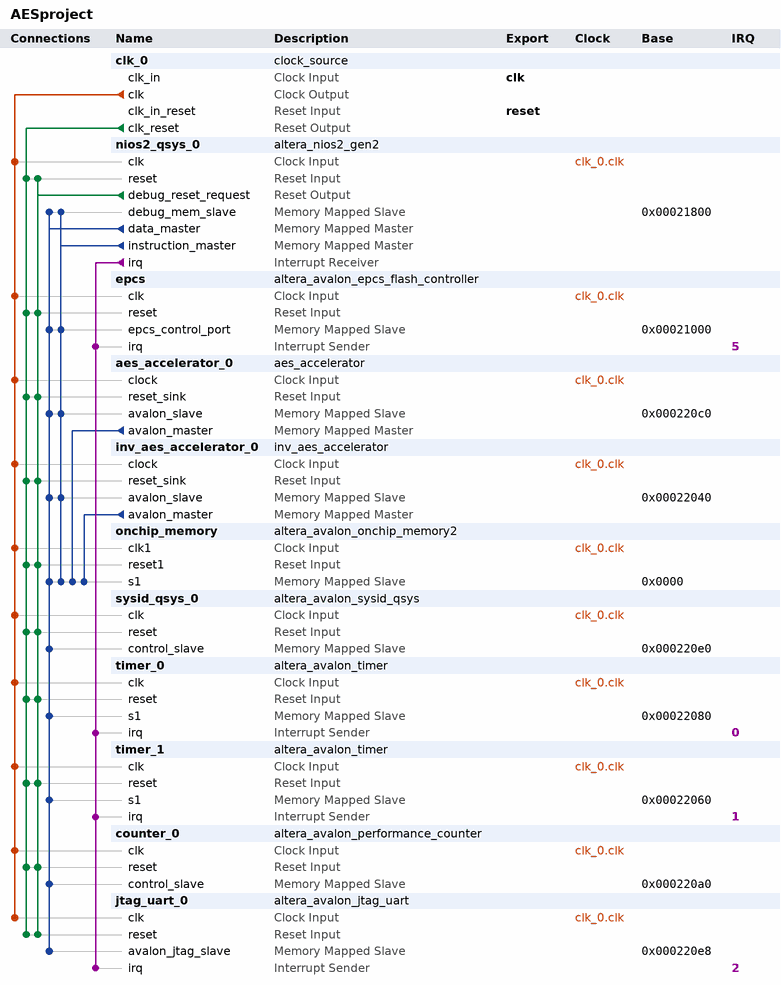
[diagram p0: system contents]
# Platform Designer (Qsys) system AESproject, Cyclone V 5CSEMA5F31C6
# Parameters at their usual value, and those the tool derives, are not listed.
package require -exact qsys 18.1
create_system AESproject
set_project_property DEVICE_FAMILY {Cyclone V}
set_project_property DEVICE 5CSEMA5F31C6

add_instance clk_0 clock_source 18.1
set_instance_parameter_value clk_0 clockFrequency 50000000

add_instance nios2_qsys_0 altera_nios2_gen2 18.1
set_instance_parameter_value nios2_qsys_0 dcache_size 0
set_instance_parameter_value nios2_qsys_0 exceptionSlave onchip_memory.s1
set_instance_parameter_value nios2_qsys_0 icache_size 4096
set_instance_parameter_value nios2_qsys_0 impl Fast
set_instance_parameter_value nios2_qsys_0 resetSlave epcs.epcs_control_port
set_instance_parameter_value nios2_qsys_0 setting_activateTrace true

add_instance epcs altera_avalon_epcs_flash_controller 18.1
set_instance_parameter_value epcs resetrequest_enabled true

add_instance aes_accelerator_0 aes_accelerator 1.0

add_instance inv_aes_accelerator_0 inv_aes_accelerator 1.0

add_instance onchip_memory altera_avalon_onchip_memory2 18.1
set_instance_parameter_value onchip_memory dataWidth 32
set_instance_parameter_value onchip_memory dualPort false
set_instance_parameter_value onchip_memory initMemContent true
set_instance_parameter_value onchip_memory initializationFileName onchip_memory
set_instance_parameter_value onchip_memory memorySize 100000

add_instance sysid_qsys_0 altera_avalon_sysid_qsys 18.1
set_instance_parameter_value sysid_qsys_0 id 0

add_instance timer_0 altera_avalon_timer 18.1
set_instance_parameter_value timer_0 period 1
set_instance_parameter_value timer_0 periodUnits MSEC

add_instance timer_1 altera_avalon_timer 18.1
set_instance_parameter_value timer_1 period 1
set_instance_parameter_value timer_1 periodUnits MSEC

add_instance counter_0 altera_avalon_performance_counter 18.1
set_instance_parameter_value counter_0 numberOfSections 1

add_instance jtag_uart_0 altera_avalon_jtag_uart 18.1
set_instance_parameter_value jtag_uart_0 readBufferDepth 256
set_instance_parameter_value jtag_uart_0 simInteractiveOptions INTERACTIVE_ASCII_OUTPUT
set_instance_parameter_value jtag_uart_0 writeBufferDepth 256

# connections
add_connection clk_0.clk aes_accelerator_0.clock clock
add_connection clk_0.clk counter_0.clk clock
add_connection clk_0.clk epcs.clk clock
add_connection clk_0.clk inv_aes_accelerator_0.clock clock
add_connection clk_0.clk jtag_uart_0.clk clock
add_connection clk_0.clk nios2_qsys_0.clk clock
add_connection clk_0.clk onchip_memory.clk1 clock
add_connection clk_0.clk sysid_qsys_0.clk clock
add_connection clk_0.clk timer_0.clk clock
add_connection clk_0.clk timer_1.clk clock
add_connection clk_0.clk_reset aes_accelerator_0.reset_sink reset
add_connection clk_0.clk_reset counter_0.reset reset
add_connection clk_0.clk_reset epcs.reset reset
add_connection clk_0.clk_reset inv_aes_accelerator_0.reset_sink reset
add_connection clk_0.clk_reset jtag_uart_0.reset reset
add_connection clk_0.clk_reset nios2_qsys_0.reset reset
add_connection clk_0.clk_reset onchip_memory.reset1 reset
add_connection clk_0.clk_reset sysid_qsys_0.reset reset
add_connection clk_0.clk_reset timer_0.reset reset
add_connection clk_0.clk_reset timer_1.reset reset
add_connection nios2_qsys_0.debug_reset_request aes_accelerator_0.reset_sink reset
add_connection nios2_qsys_0.debug_reset_request counter_0.reset reset
add_connection nios2_qsys_0.debug_reset_request epcs.reset reset
add_connection nios2_qsys_0.debug_reset_request inv_aes_accelerator_0.reset_sink reset
add_connection nios2_qsys_0.debug_reset_request jtag_uart_0.reset reset
add_connection nios2_qsys_0.debug_reset_request nios2_qsys_0.reset reset
add_connection nios2_qsys_0.debug_reset_request onchip_memory.reset1 reset
add_connection nios2_qsys_0.debug_reset_request sysid_qsys_0.reset reset
add_connection nios2_qsys_0.debug_reset_request timer_0.reset reset
add_connection nios2_qsys_0.debug_reset_request timer_1.reset reset
add_connection aes_accelerator_0.avalon_master onchip_memory.s1 avalon
set_connection_parameter_value aes_accelerator_0.avalon_master/onchip_memory.s1 baseAddress 0x0000
add_connection inv_aes_accelerator_0.avalon_master onchip_memory.s1 avalon
set_connection_parameter_value inv_aes_accelerator_0.avalon_master/onchip_memory.s1 baseAddress 0x0000
add_connection nios2_qsys_0.data_master aes_accelerator_0.avalon_slave avalon
set_connection_parameter_value nios2_qsys_0.data_master/aes_accelerator_0.avalon_slave baseAddress 0x000220c0
add_connection nios2_qsys_0.data_master counter_0.control_slave avalon
set_connection_parameter_value nios2_qsys_0.data_master/counter_0.control_slave baseAddress 0x000220a0
add_connection nios2_qsys_0.data_master epcs.epcs_control_port avalon
set_connection_parameter_value nios2_qsys_0.data_master/epcs.epcs_control_port baseAddress 0x00021000
add_connection nios2_qsys_0.data_master inv_aes_accelerator_0.avalon_slave avalon
set_connection_parameter_value nios2_qsys_0.data_master/inv_aes_accelerator_0.avalon_slave baseAddress 0x00022040
add_connection nios2_qsys_0.data_master jtag_uart_0.avalon_jtag_slave avalon
set_connection_parameter_value nios2_qsys_0.data_master/jtag_uart_0.avalon_jtag_slave baseAddress 0x000220e8
add_connection nios2_qsys_0.data_master nios2_qsys_0.debug_mem_slave avalon
set_connection_parameter_value nios2_qsys_0.data_master/nios2_qsys_0.debug_mem_slave baseAddress 0x00021800
add_connection nios2_qsys_0.data_master onchip_memory.s1 avalon
set_connection_parameter_value nios2_qsys_0.data_master/onchip_memory.s1 baseAddress 0x0000
add_connection nios2_qsys_0.data_master sysid_qsys_0.control_slave avalon
set_connection_parameter_value nios2_qsys_0.data_master/sysid_qsys_0.control_slave baseAddress 0x000220e0
add_connection nios2_qsys_0.data_master timer_0.s1 avalon
set_connection_parameter_value nios2_qsys_0.data_master/timer_0.s1 baseAddress 0x00022080
add_connection nios2_qsys_0.data_master timer_1.s1 avalon
set_connection_parameter_value nios2_qsys_0.data_master/timer_1.s1 baseAddress 0x00022060
add_connection nios2_qsys_0.instruction_master aes_accelerator_0.avalon_slave avalon
set_connection_parameter_value nios2_qsys_0.instruction_master/aes_accelerator_0.avalon_slave baseAddress 0x000220c0
add_connection nios2_qsys_0.instruction_master epcs.epcs_control_port avalon
set_connection_parameter_value nios2_qsys_0.instruction_master/epcs.epcs_control_port baseAddress 0x00021000
add_connection nios2_qsys_0.instruction_master inv_aes_accelerator_0.avalon_slave avalon
set_connection_parameter_value nios2_qsys_0.instruction_master/inv_aes_accelerator_0.avalon_slave baseAddress 0x00022040
add_connection nios2_qsys_0.instruction_master nios2_qsys_0.debug_mem_slave avalon
set_connection_parameter_value nios2_qsys_0.instruction_master/nios2_qsys_0.debug_mem_slave baseAddress 0x00021800
add_connection nios2_qsys_0.instruction_master onchip_memory.s1 avalon
set_connection_parameter_value nios2_qsys_0.instruction_master/onchip_memory.s1 baseAddress 0x0000
add_connection nios2_qsys_0.irq epcs.irq interrupt
set_connection_parameter_value nios2_qsys_0.irq/epcs.irq irqNumber 5
add_connection nios2_qsys_0.irq jtag_uart_0.irq interrupt
set_connection_parameter_value nios2_qsys_0.irq/jtag_uart_0.irq irqNumber 2
add_connection nios2_qsys_0.irq timer_0.irq interrupt
set_connection_parameter_value nios2_qsys_0.irq/timer_0.irq irqNumber 0
add_connection nios2_qsys_0.irq timer_1.irq interrupt
set_connection_parameter_value nios2_qsys_0.irq/timer_1.irq irqNumber 1

# exported interfaces
add_interface clk clock sink
set_interface_property clk EXPORT_OF clk_0.clk_in
add_interface reset reset sink
set_interface_property reset EXPORT_OF clk_0.clk_in_reset

set_interconnect_requirement {$system} qsys_mm.clockCrossingAdapter HANDSHAKE
set_interconnect_requirement {$system} qsys_mm.maxAdditionalLatency 1

save_system AESproject.qsys
